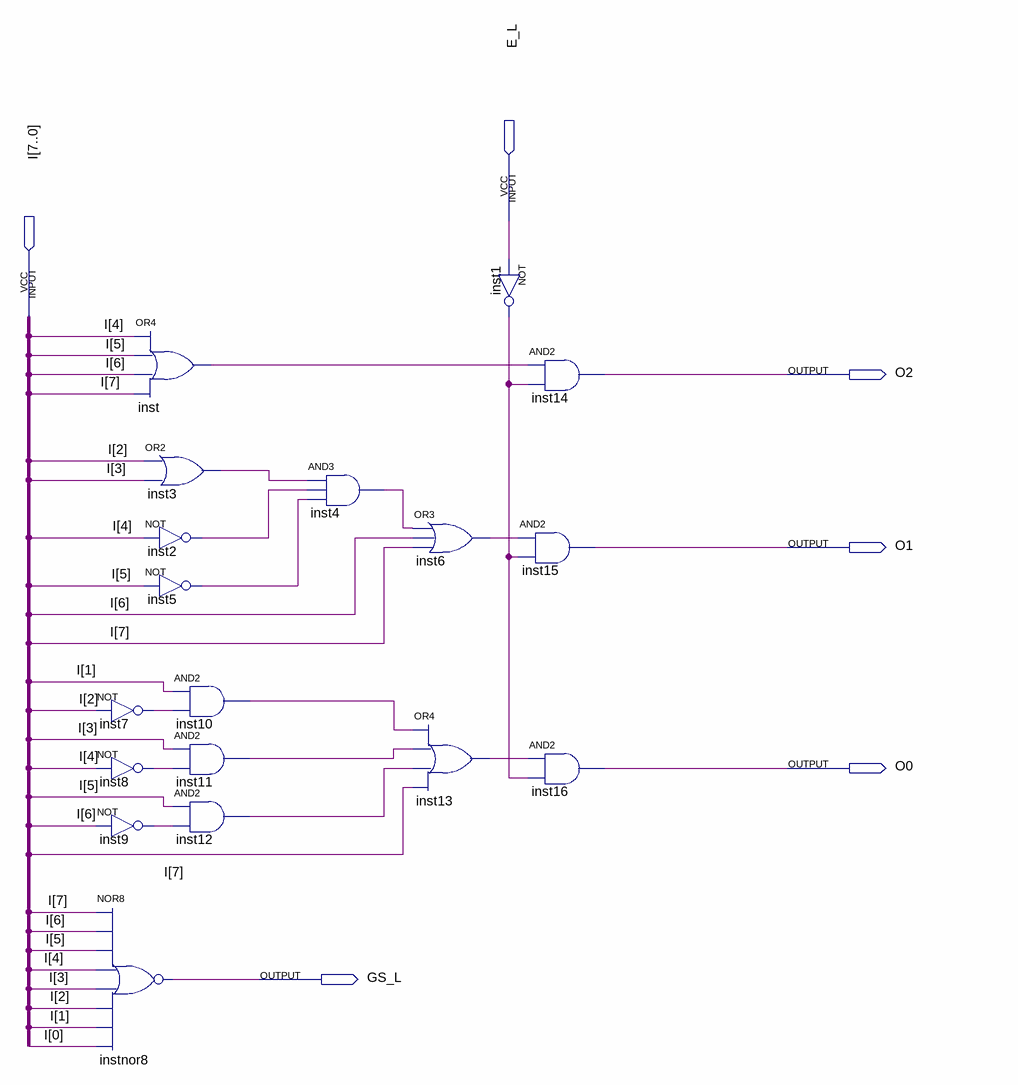
[diagram p0: schematic sheet]
// Quartus schematic PEnc8_3.bdf as structural Verilog: 18 symbols, 6 pins
module PEnc8_3 (
  input  E_L,
  input  [7:0] I,
  output O2,
  output O1,
  output O0,
  output GS_L
);

  wire inst1_out, inst2_out, inst3_out, inst4_out, inst5_out, inst6_out, inst7_out, inst8_out, inst9_out,
       inst10_out, inst11_out, inst12_out, inst13_out, inst_out;

  not inst7 (inst7_out, I[2]);
  not inst8 (inst8_out, I[4]);
  not inst9 (inst9_out, I[6]);
  nor instnor8 (GS_L, I[7], I[6], I[5], I[4], I[3], I[2], I[1], I[0]);
  or inst (inst_out, I[4], I[5], I[6], I[7]);
  or inst3 (inst3_out, I[2], I[3]);
  not inst2 (inst2_out, I[4]);
  not inst5 (inst5_out, I[5]);
  and inst10 (inst10_out, I[1], inst7_out);
  and inst11 (inst11_out, I[3], inst8_out);
  and inst12 (inst12_out, I[5], inst9_out);
  and inst4 (inst4_out, inst3_out, inst2_out, inst5_out);
  or inst6 (inst6_out, inst4_out, I[6], I[7]);
  or inst13 (inst13_out, inst10_out, inst11_out, inst12_out, I[7]);
  not inst1 (inst1_out, E_L);
  and inst14 (O2, inst_out, inst1_out);
  and inst15 (O1, inst6_out, inst1_out);
  and inst16 (O0, inst13_out, inst1_out);
endmodule
